# EAGLE design au6850_mp3 (EAGLE 9.0.0)
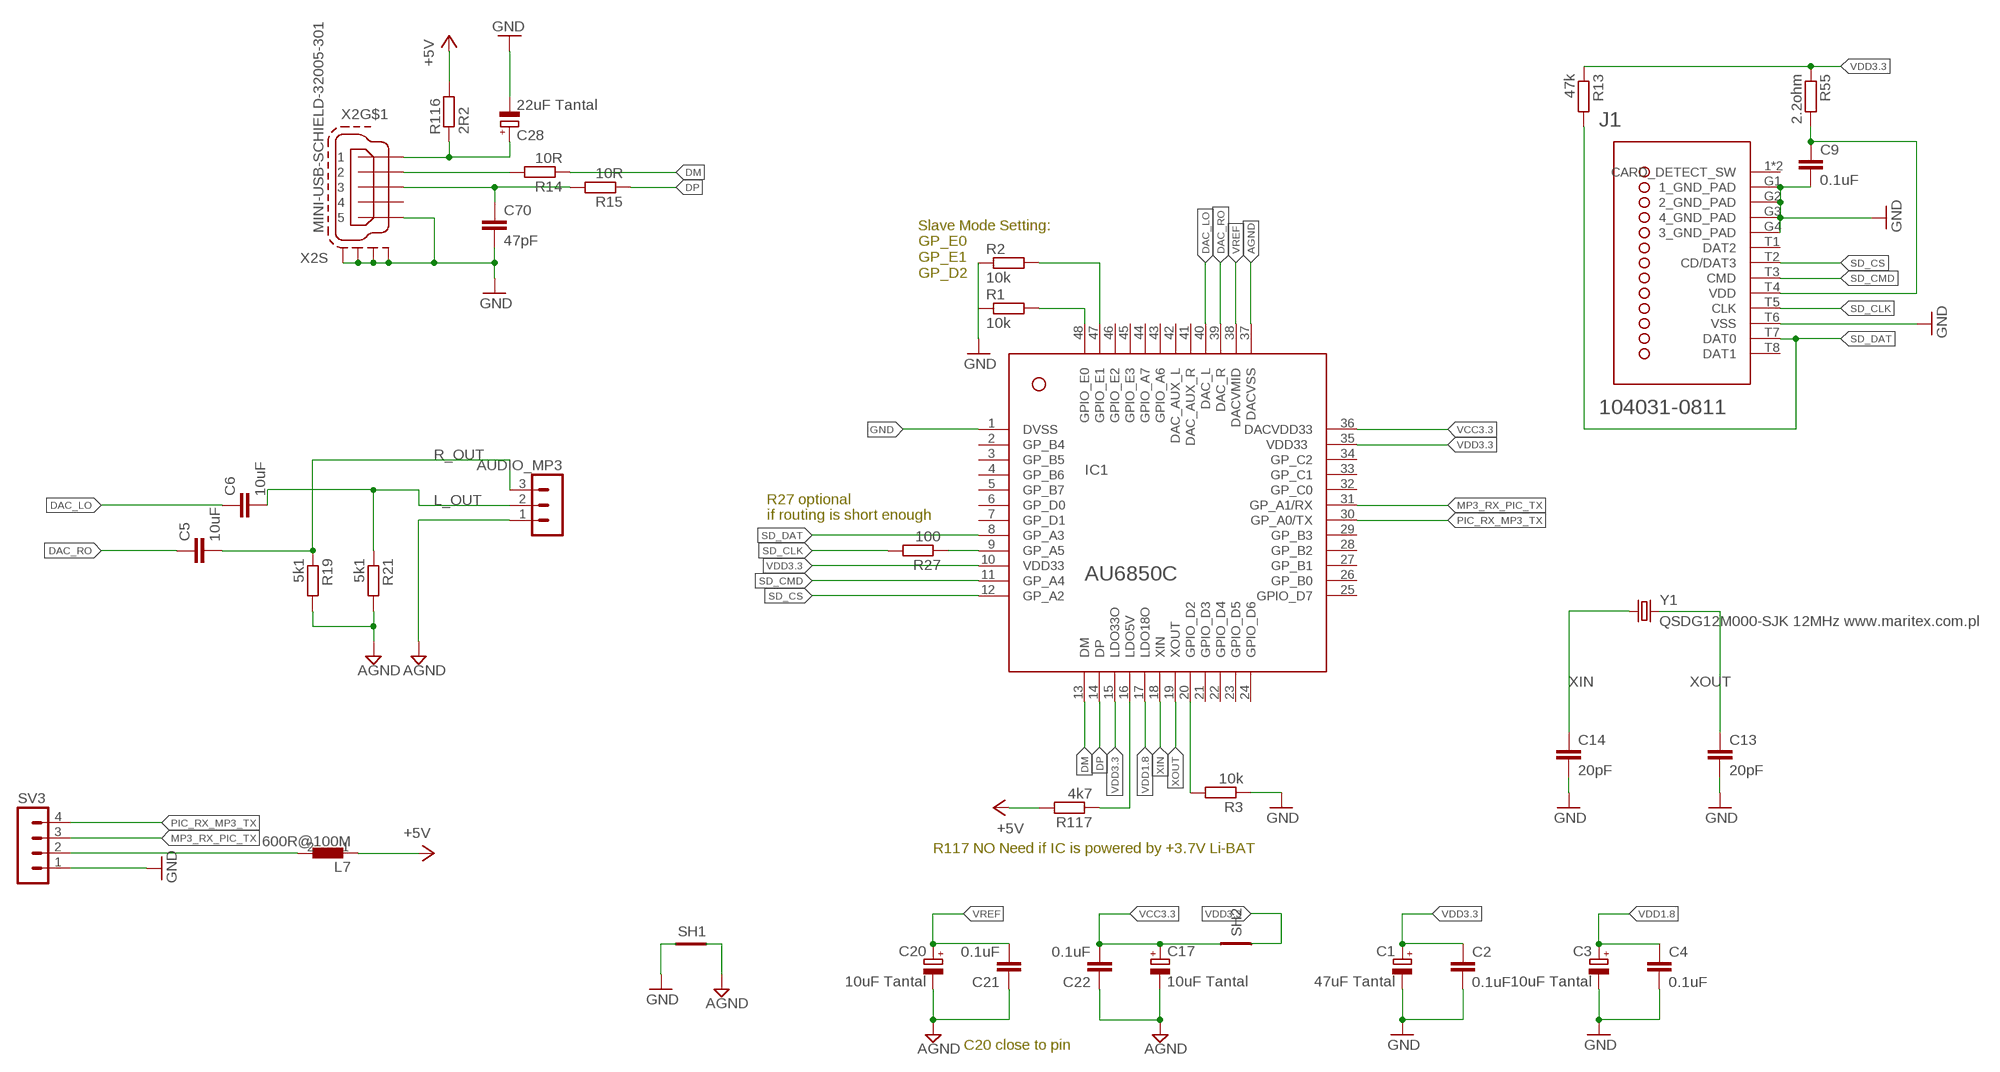
[diagram p0: schematic, sheet 1]

## Parts
AUDIO_MP3  MA03-1  [MA03-1]
C1  47uF Tantal  CPOL-EUB/3528-21R  [B/3528-21R]
C2  0.1uF  C-EUC0805  [C0805]
C3  10uF Tantal  CPOL-EUB/3528-21R  [B/3528-21R]
C4  0.1uF  C-EUC0805  [C0805]
C5  10uF  C-EUC0805  [C0805]
C6  10uF  C-EUC0805  [C0805]
C9  0.1uF  C-EUC0805  [C0805]
C13  20pF  C-EUC0805  [C0805]
C14  20pF  C-EUC0805  [C0805]
C17  10uF Tantal  CPOL-EUB/3528-21R  [B/3528-21R]
C20  10uF Tantal  CPOL-EUB/3528-21R  [B/3528-21R]
C21  0.1uF  C-EUC0805  [C0805]
C22  0.1uF  C-EUC0805  [C0805]
C28  22uF Tantal  CPOL-EUSMCA  [SMC_A]
C70  47pF  C-EUC0805  [C0805]
IC1  AU6850C  [LQFP48-7X7]
J1  MOLEX_104031-0811MOLEX_104031-0811_0_0  [MOLEX_104031-0811_0]
L7  600R@100M  FERRITR0805  [R0805]
R1  10k  R-EU_R0805  [R0805]
R2  10k  R-EU_R0805  [R0805]
R3  10k  R-EU_R0805  [R0805]
R13  47k  R-EU_R0805  [R0805]
R14  10R  R-EU_R0805  [R0805]
R15  10R  R-EU_R0805  [R0805]
R19  5k1  R-EU_R0805  [R0805]
R21  5k1  R-EU_R0805  [R0805]
R27  100  R-EU_R0805  [R0805]
R55  2.2ohm  R-EU_R0805  [R0805]
R116  2R2  R-EU_R0805  [R0805]
R117  4k7  R-EU_R0805  [R0805]
SH1  SHORT-HT5  [SHORT_TOP-50]
SH2  SHORT-V12_MILS  [12_MILS]
SV3  MA04-1  [MA04-1]
X2  MINI-USB-SCHIELD-32005-301  [32005-301]
Y1  QSDG12M000-SJK 12MHz www.maritex.com.pl  CRYSTALTXC-7A  [CRYSTAL-TXC-7A]

## Nets
+5V: L7.1 R116.2 R117.2
AGND: AUDIO_MP3.1 C17.- C20.- C21.1 C22.1 IC1.37(DACVSS) R19.2 R21.2 SH1.2
DAC_LO: C6.1 IC1.40(DAC_L)
DAC_RO: C5.1 IC1.39(DAC_R)
DM: IC1.13(DM) R14.1
DP: IC1.14(DP) R15.1
GND: C1.- C2.2 C3.- C4.2 C9.2 C13.2 C14.2 C28.- C70.2 IC1.1(DVSS) J1.G1(1_GND_PAD) J1.G2(2_GND_PAD) J1.G3(4_GND_PAD) J1.G4(3_GND_PAD) J1.T6(VSS) R1.1 R2.1 R3.1 SH1.1 SV3.1 X2.5 X2.M1(S:S1) X2.M2(S:S2) X2.M3(S:S3) X2.M4(S:S4)
L_OUT: AUDIO_MP3.2 C6.2 R21.1
MP3_RX_PIC_TX: IC1.31(GP_A1/RX) SV3.3
N$4: IC1.16(LDO5V) R117.1
N$5: IC1.9(GP_A5) R27.1
N$8: C28.+ R116.1 X2.1
N$9: C70.1 R15.2 X2.3
N$10: R14.2 X2.2
N$13: L7.2 SV3.2
N$14: C9.1 J1.T4(VDD) R55.2
PIC_RX_MP3_TX: IC1.30(GP_A0/TX) SV3.4
R_OUT: AUDIO_MP3.3 C5.2 R19.1
SD_CLK: J1.T5(CLK) R27.2
SD_CMD: IC1.11(GP_A4) J1.T3(CMD)
SD_CS: IC1.12(GP_A2) J1.T2(CD/DAT3)
SD_DAT: IC1.8(GP_A3) J1.T7(DAT0) R13.2
SLAVE_D2: IC1.20(GPIO_D2) R3.2
SLAVE_E0: IC1.48(GPIO_E0) R1.2
SLAVE_E1: IC1.47(GPIO_E1) R2.2
VCC3.3: C17.+ C22.2 IC1.36(DACVDD33) SH2.P$2
VDD1.8: C3.+ C4.1 IC1.17(LDO18O)
VDD3.3: C1.+ C2.1 IC1.10(VDD33) IC1.15(LDO33O) IC1.35(VDD33) R13.1 R55.1 SH2.P$1
VREF: C20.+ C21.2 IC1.38(DACVMID)
XIN: C14.1 IC1.18(XIN) Y1.P$1
XOUT: C13.1 IC1.19(XOUT) Y1.P$2
Unconnected: IC1.2(GP_B4) IC1.3(GP_B5) IC1.4(GP_B6) IC1.5(GP_B7) IC1.6(GP_D0) IC1.7(GP_D1) IC1.21(GPIO_D3) IC1.22(GPIO_D4) IC1.23(GPIO_D5) IC1.24(GPIO_D6) IC1.25(GPIO_D7) IC1.26(GP_B0) IC1.27(GP_B1) IC1.28(GP_B2) IC1.29(GP_B3) IC1.32(GP_C0) IC1.33(GP_C1) IC1.34(GP_C2) IC1.41(DAC_AUX_R) IC1.42(DAC_AUX_L) IC1.43(GPIO_A6) IC1.44(GPIO_A7) IC1.45(GPIO_E3) IC1.46(GPIO_E2) J1.1(CARD_DETECT_SW) J1.1-2(CARD_DETECT_SW) J1.T1(DAT2) J1.T8(DAT1) X2.4

## Notes on the sheet
- Slave Mode Setting:
  GP_E0
  GP_E1
  GP_D2
- R27 optional
  if routing is short enough
- R117 NO Need if IC is powered by +3.7V Li-BAT
- C20 close to pin

## Library data of the parts
AUDIO_MP3 = con-lstb:MA03-1: PIN HEADER; OC_FARNELL: unknown; OC_NEWARK: unknown
C1 C3 C17 C20 C28 = rcl:CPOL-EU: POLARIZED CAPACITOR, European symbol
C2 C4-C6 C21 C22 = rcl:C-EU: CAPACITOR, European symbol
C9 C13 C14 C70 = resistor:C-EU: CAPACITOR, European symbol
IC1 = mvsilicon:AU6850C
J1 = Molex - 104031-0811:MOLEX_104031-0811: 1.10mm Pitch microSD* Memory Card Connector, Surface Mount, Push-Pull Type, 1.42mm Height, with Detect Switch; CENTROID_NOT_SPECIFIED: No; DATASHEET: http://www.molex.com/pdm_docs/sd/1040310811_sd.pdf; DIGIKEY_DESCRIPTION: CONN MICRO SD CARD PUSH-PULL R/A; DIGIKEY_PART_NUMBER: WM6357CT-ND; IS_FEMALE: yes; LEAD_FREE: yes; MF: Molex; MOUSER_PART_NUMBER: WM6357CT-ND; MPN: 104031-0811; PACKAGE: SMT_MICROSD_SOCKET; PREFIX: J; ROHS: yes; TEMPERATURE_RANGE_HIGH: +85°C; TEMPERATURE_RANGE_LOW: -25°C
L7 = ferrit_bear:FERRIT
R1-R3 R13-R15 R19 R21 R27 R55 R116 R117 = rcl:R-EU_: RESISTOR, European symbol
SH1 = shorts-old:SHORT-H: Short between two nets; BOM: no
SH2 = shorts-old:SHORT-V: Short between two nets
SV3 = con-lstb:MA04-1: PIN HEADER; OC_FARNELL: unknown; OC_NEWARK: unknown
X2 = con-cypressindustries:MINI-USB-SCHIELD-: MINI USB-B Conector Source: www.cypressindustries.com; OC_FARNELL: unknown; OC_NEWARK: unknown
Y1 = SparkFun-FreqCtrl:CRYSTAL: Various standard crystals. Proven footprints. Spark Fun Electronics SKU : COM-00534

## Board
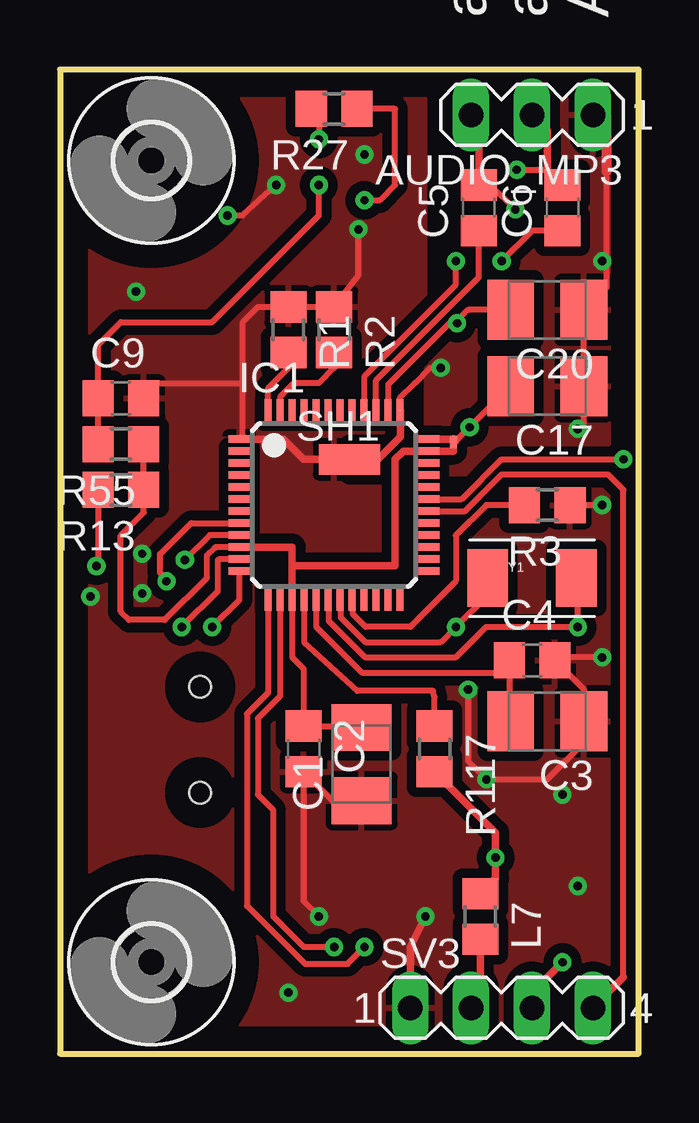
[diagram p1: board, top side]
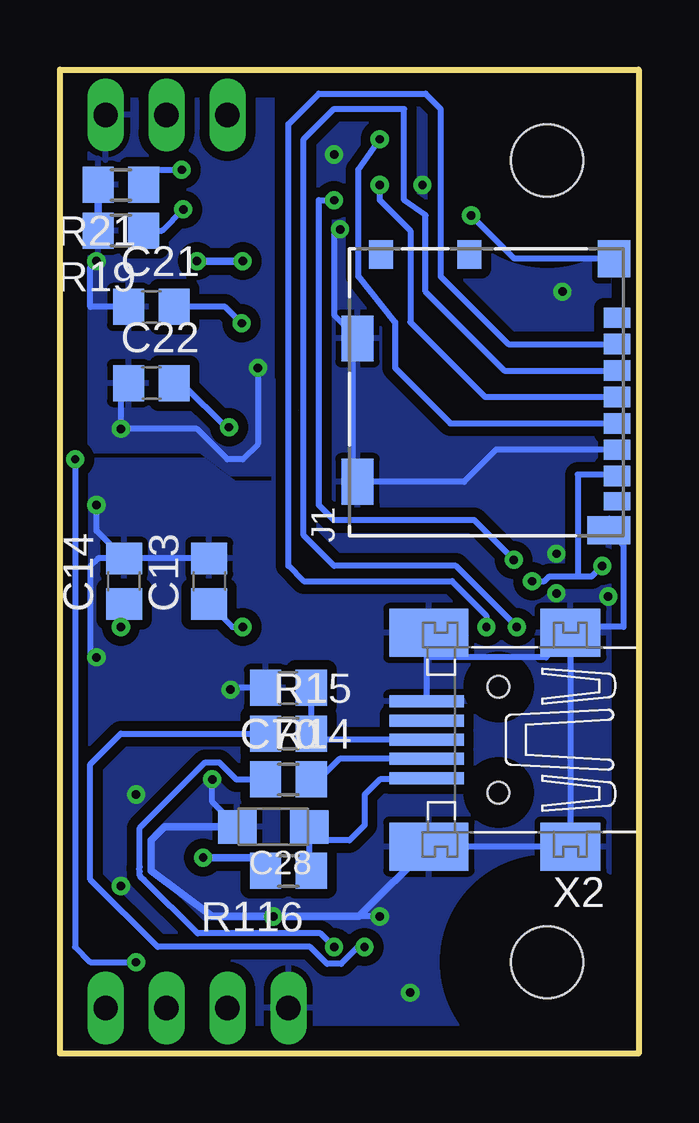
[diagram p2: board, bottom side, seen from below]

Size 24.13 x 41 mm. Coordinates in mm from the lower left corner, seen from the top.
Outline: 0,0 24.13,0 24.13,41 0,41 0,0
Copper layers (1*16): Top 0.035mm / dielectric 1.5mm / Bottom 0.035mm
Design rules "default *": minimum track width 10mil, minimum drill 24mil, track to track 8mil, track to pad 8mil, pad to pad 8mil, via to via 8mil, smd to smd 8mil, copper to edge 40mil, drill to drill 8mil, minimum pad ring 10mil, minimum via ring 8mil, stop-mask expansion 4mil, vias tented up to drill 0mil, thermal gap 10mil

### Footprints (pad centres in the part's own frame; a part is rotated, then mirrored left to right if it is on the bottom)
MA03-1 = drill 1.016 long: 1 -2.54,0; 2 0,0; 3 2.54,0
B/3528-21R = smd 1.95 x 2.5: + 1.525,0; - -1.525,0
C0805 = smd 1.3 x 1.5: 1 -0.95,0; 2 0.95,0
SMC_A = smd 1.6 x 1.4: + -1.5,0; - 1.5,0
LQFP48-7X7 = smd 0.9 x 0.3: 1 -3.95,2.75; 2 -3.95,2.25; 3 -3.95,1.75; 4 -3.95,1.25; 5 -3.95,0.75; 6 -3.95,0.25; 7 -3.95,-0.25; 8 -3.95,-0.75; 9 -3.95,-1.25; 10 -3.95,-1.75; 11 -3.95,-2.25; 12 -3.95,-2.75; 25 3.95,-2.75; 26 3.95,-2.25; 27 3.95,-1.75; 28 3.95,-1.25; 29 3.95,-0.75; 30 3.95,-0.25; 31 3.95,0.25; 32 3.95,0.75; 33 3.95,1.25; 34 3.95,1.75; 35 3.95,2.25; 36 3.95,2.75 | smd 0.3 x 0.9: 13 -2.75,-3.95; 14 -2.25,-3.95; 15 -1.75,-3.95; 16 -1.25,-3.95; 17 -0.75,-3.95; 18 -0.25,-3.95; 19 0.25,-3.95; 20 0.75,-3.95; 21 1.25,-3.95; 22 1.75,-3.95; 23 2.25,-3.95; 24 2.75,-3.95; 37 2.75,3.95; 38 2.25,3.95; 39 1.75,3.95; 40 1.25,3.95; 41 0.75,3.95; 42 0.25,3.95; 43 -0.25,3.95; 44 -0.75,3.95; 45 -1.25,3.95; 46 -1.75,3.95; 47 -2.25,3.95; 48 -2.75,3.95
MOLEX_104031-0811_0 = smd 1.2 x 1: 1 5.74,4.4; 1-2 5.74,0.7 | smd 1.55 x 1.35: G1 5.565,-5.325 | smd 1.17 x 1.8: G2 -5.755,-5.1 | smd 1.9 x 1.35: G3 -3.73,5.375; G4 2.24,5.375 | smd 0.85 x 1.1: T1 3.105,-5.45; T2 2.005,-5.45; T3 0.905,-5.45; T4 -0.195,-5.45; T5 -1.295,-5.45; T6 -2.395,-5.45; T7 -3.495,-5.45 | smd 0.75 x 1.1: T8 -4.545,-5.45
R0805 = smd 1.3 x 1.5: 1 -0.95,0; 2 0.95,0
SHORT_TOP-50 = smd 1.27 x 1.27: 1 0.635,0; 2 -0.635,0
12_MILS = smd 0.254 x 0.305: P$1 -0.127,0; P$2 0.127,0
MA04-1 = drill 1.016 long: 1 -3.81,0; 2 -1.27,0; 3 1.27,0; 4 3.81,0
3,0 = hole 3: 0,0
32005-301 = smd 3.1 x 0.5: 1 3,1.6; 2 3,0.8; 3 3,0; 4 3,-0.8; 5 3,-1.6 | smd 2.5 x 2: M1 -3,-4.45; M2 -3,4.45 | smd 3.3 x 2: M3 2.9,4.45; M4 2.9,-4.45 | hole 0.9: 0,2.2; 0,-2.2
CRYSTAL-TXC-7A = smd 1.7 x 2.4: P$1 1.85,0; P$2 -1.85,0

### Placement (x,y rotation side)
AUDIO_MP3  19.69,39.12 180 top
C1  12.57,12.06 90 top
C2  10.16,12.7 270 top
C3  20.32,13.84 180 top
C4  19.69,16.38 0 top
C5  17.46,35.24 90 top
C6  20.95,35.24 90 top
C9  2.54,27.3 0 top
C13  17.91,19.68 90 bottom
C14  21.46,19.68 90 bottom
C17  20.32,27.81 180 top
C20  20.32,30.99 180 top
C21  20.32,31.11 0 bottom
C22  20.32,27.94 0 bottom
C28  15.24,9.45 180 bottom
C70  14.6,15.24 180 bottom
IC1  11.43,22.86 0 top
J1  6.35,27.56 90 bottom
L7  17.53,5.71 270 top
R1  9.52,30.16 270 top
R2  11.43,30.16 270 top
R3  20.32,22.86 180 top
R13  2.54,23.5 180 top
R14  14.6,11.43 0 bottom
R15  14.6,13.34 0 bottom
R19  21.59,34.29 180 bottom
R21  21.59,36.2 180 bottom
R27  11.43,39.37 180 top
R55  2.54,25.4 180 top
R116  14.6,7.62 180 bottom
R117  15.62,12.7 270 top
SH1  12.06,24.77 180 top
SH2  16.41,25.49 90 top
SV3  18.41,1.91 0 top
U$1  [3,0]  3.81,37.21 0 top
U$2  [3,0]  3.81,3.81 0 top
X2  5.84,13.08 180 bottom
Y1  19.69,19.81 0 top

### Tracks (layer width: path | path; a pad name or v marks a point on that pad's centre or on a via)
+5V  (via drill 0.35)
  Top 0.305: R117.2 18.16,9.21 v18.16,8.17 18.16,7.3 L7.1
  Bottom 0.305: R116.2 16.1,8.17 v18.16,8.17
AGND  (via drill 0.35)  (1 unrouted)
  Top 0.254: IC1.37 14.18,27.09 14.16,27.11 14.16,27.3 14.8,27.94 15.43,28.57 v15.88,28.57 | v21.59,26.04 21.84,26.29 C17.- C20.- 22.78,31.93 22.78,33.02 | 22.78,36.75 22.78,33.02 | v22.61,33.02 22.78,33.02
  Top 0.305: SH1.2 13.25,24.77 14.19,25.7 IC1.37
  Top 0.406: 22.78,39.05 22.78,36.75
  Bottom 0.254: C22.1 21.59,27.62 v21.59,26.04 18.41,26.04 17.14,24.77 16.51,24.77 15.88,25.4 v15.88,28.57 | 21.27,31.68 C21.1 22.86,31.11 22.86,32.77 v22.61,33.02
  Bottom 0.305: R19.2 R21.2
  pour Bottom (isolate 0.406): 15.24,41.91 15.24,24.13 17.02,24.13 18.29,25.08 26.03,25.08 26.03,41.91
  pour Top (isolate 0.406): 15.24,41.91 15.24,24.13 17.02,24.13 18.29,25.08 26.03,25.08 26.03,41.91
DAC_LO  (via drill 0.35)
  Top 0.254: IC1.40 12.7,26.83 12.7,28.23 16.51,32.04 v16.51,33.02 | C6.1 19.69,34.29 v18.41,33.02
  Bottom 0.305: v18.41,33.02 v16.51,33.02
DAC_RO
  Top 0.254: IC1.39 13.18,28.06 16.05,30.94 16.16,31.04 17.46,32.34 C5.1
DM  (via drill 0.35)
  Top 0.254: IC1.13 8.68,15.04 7.8,14.16 7.8,6.16 10.22,3.74 11.99,3.74 v12.7,4.45
  Bottom 0.254: v12.7,4.45 13.26,5.01 18.39,5.01 20.64,7.25 20.77,7.35 20.77,7.39 20.8,7.42 20.8,7.59 20.83,7.75 20.8,7.78 20.8,9.41 18.07,12.14 17.49,12.14 16.78,11.43 R14.1
DP  (via drill 0.35)
  Top 0.254: 9.16,18.89 IC1.14 9.18,14.89 8.25,13.97 8.25,10.79 8.89,10.16 8.89,5.71 10.16,4.45 v11.43,4.45
  Bottom 0.254: R15.1 21.59,13.34 22.86,12.06 22.86,7.25 20.05,4.45 13.7,4.45 12.99,3.74 12.41,3.74 11.7,4.45 v11.43,4.45
GND  (via drill 0.35)
  Top 0.254: v22.61,22.86 R3.1 | v22.61,16.51 20.76,16.51 C4.2 21.84,15.17 C3.- 21.84,12.96 20.32,11.43 v17.78,11.43 17.02,12.19 v17.02,15.17 | C1.- 11.37,10.54 C2.2 10.16,6.35 v10.79,5.71 | v12.45,34.35 12.45,32.44 R2.1 R1.1 8.26,31.11 7.62,30.47 7.62,27.94 | IC1.1 7.62,25.75 7.62,27.94 | v6.98,34.92 7.62,34.92 v9.02,36.2 | C9.2 4.12,27.94 7.62,27.94
  Top 0.305: IC1.1 9.31,25.61 10.16,24.77 SH1.1 | SV3.1 14.6,4.45 v15.24,5.71
  Bottom 0.152: J1.G2 1.22,21.8 1.22,22.36
  Bottom 0.254: 9.52,17.78 8.89,18.41 8.74,18.27 X2.M4 8.84,17.43 8.84,16.51 | X2.M3 X2.M2 X2.M1 | 8.84,16.51 X2.5 | C13.2 C14.2 | C14.2 22.61,21.78 v22.61,22.86 | X2.M1 3.86,16.51 8.84,16.51 | C14.2 22.55,20.64 22.86,20.32 22.86,16.51 v22.61,16.51 | C70.2 17.14,15.24 v17.02,15.17 | C28.- 17.78,10.49 v17.78,11.43 | v12.45,34.35 12.7,34.29 12.7,30.77 11.92,29.99 | 11.92,29.99 J1.G4 | J1.T6 5.95,25.16 7.29,23.83 J1.G3 11.92,24.02 11.92,29.99 | J1.G2 0.63,21.19 0.63,17.78 2.59,17.78 X2.M1 | J1.G1 5.18,33.12 v6.98,34.92 | v10.79,5.71 11.66,5.71
  Bottom 0.305: X2.M3 11.66,5.71 v15.24,5.71 17.78,5.71 20.32,7.62 20.32,8.89 19.76,9.45 C28.-
  other vias: 12.7,37.47 3.17,31.75 20.95,10.79 21.59,6.99 9.52,2.54 1.27,19.05 3.43,20.83 3.43,19.18
  pour Top (isolate 0.406): -1.59,41.91 15.24,41.91 15.24,23.81 16.83,23.81 18.1,24.77 25.72,24.77 25.72,-1.91 25.4,-1.59 -1.59,-1.59
  pour Bottom (isolate 0.406): -1.59,41.91 15.24,41.91 15.24,23.81 16.83,23.81 18.1,24.77 26.99,24.77 26.99,-1.59 -1.59,-1.59
L_OUT  (via drill 0.35)
  Top 0.254: v19.05,36.83 20.32,36.83 C6.2
  Top 0.305: v19.05,36.83 | AUDIO_MP3.2 20.32,38.48 20.32,36.83
  Bottom 0.254: R21.1 20,36.83 v19.05,36.83
MP3_RX_PIC_TX  (via drill 0.35)
  Top 0.254: IC1.31 16.76,23.11 18.41,24.77 v23.49,24.77
  Top 0.305: v20.95,3.81 19.69,2.54 SV3.3
  Bottom 0.254: v23.49,24.77 23.49,4.45 22.86,3.81 v20.95,3.81
N$4
  Top 0.254: IC1.16 10.18,17.14 | 10.18,17.14 10.18,17.12 | R117.1 15.62,14.86 15.56,15.11 12.4,15.11 10.18,17.14
N$5  (via drill 0.35)
  Top 0.254: R27.1 13.97,39.37 13.97,36.2 13.33,35.56 v12.7,35.56 | IC1.9 6.24,21.61 v5.21,20.57
  Bottom 0.254: v12.7,35.56 13.33,35.56 13.33,22.86 12.7,22.23 6.86,22.23 v5.21,20.57
N$8
  Bottom 0.254: C28.+ 13.74,8.89 | 13.74,8.89 13.74,8.34 R116.1 | X2.1 8.89,11.43 10.79,11.43 11.43,10.79 11.43,9.53 12.06,8.89 13.74,8.89
N$9
  Bottom 0.254: C70.1 R15.2 14.04,13.08 X2.3
N$10
  Bottom 0.254: X2.2 12.48,12.28 13.33,11.43 R14.2
N$13
  Top 0.305: SV3.2 17.53,2.29 L7.2
N$14  (via drill 0.35)
  Top 0.254: R55.2 C9.1 1.59,29.53 2.54,30.48 6.35,30.48 10.79,34.92 v10.79,36.2
  Bottom 0.254: v10.79,36.2 10.79,35.56 9.52,34.29 9.52,30.48 6.41,27.36 J1.T4
PIC_RX_MP3_TX
  Top 0.254: 15.4,22.59 IC1.30 16.89,22.61 18.41,24.13 22.86,24.13 23.49,23.5 23.49,3.17
  Top 0.305: 23.49,3.17 SV3.4
R_OUT  (via drill 0.35)
  Top 0.254: v18.99,35.18 17.98,36.19 17.72,36.19
  Top 0.305: 17.72,36.19 C5.2 17.46,38.8 AUDIO_MP3.3
  Bottom 0.254: R19.1 19.88,34.29 v18.99,35.18
SD_CLK  (via drill 0.35)
  Top 0.254: R27.2 10.79,39.05 v10.79,38.1
  Bottom 0.254: J1.T5 7.85,26.26 10.16,28.57 10.16,30.48 11.68,32.38 11.68,36.83 v10.79,38.1
SD_CMD  (via drill 0.35)
  Top 0.254: IC1.11 6.64,20.61 6.6,20.57 6.59,20.57 6.59,19.29 v5.08,17.78
  Bottom 0.254: J1.T3 5.6,28.46 8.89,31.75 8.89,34.92 9.78,35.56 9.78,39.37 12.7,39.37 13.97,38.1 13.97,21.59 12.7,20.32 7.62,20.32 v5.08,17.78
SD_CS  (via drill 0.35)
  Top 0.254: v6.35,17.78 7.48,18.91 IC1.12
  Bottom 0.254: J1.T2 5.43,29.56 8.25,32.38 8.25,39.37 8.89,40.01 13.33,40.01 14.6,38.73 14.6,20.32 13.97,19.68 7.78,19.68 6.35,18.26 v6.35,17.78
SD_DAT  (via drill 0.35)
  Top 0.254: 1.3,23.2 R13.2 1.59,20.39 v1.52,20.32 | v4.45,19.68 4.18,20.05 4.18,20.81 5.48,22.11 IC1.8
  Bottom 0.254: J1.T7 0.97,24.13 2.54,24.13 2.54,19.89 | 1.68,20.48 v1.52,20.32 1.96,19.89 2.54,19.89 | v4.45,19.68 3.92,19.68 3.72,19.89 2.54,19.89
SLAVE_D2
  Top 0.254: IC1.20 12.2,18.89 12.2,18.32 12.74,17.78 14.6,17.78 16.51,19.68 16.51,21.59 17.78,22.86 R3.2
SLAVE_E0
  Top 0.254: IC1.48 8.68,27.73 9.52,28.57 R1.2
SLAVE_E1
  Top 0.254: IC1.47 9.2,26.83 9.2,27.4 9.74,27.94 10.79,27.94 11.43,28.57 R2.2
VCC3.3  (via drill 0.35)
  Top 0.254: SH2.P$2 16.6,25.62 v17.08,26.1 C17.+
  Top 0.305: IC1.36 SH2.P$2 | SH2.P$2 | 16.49,25.53 SH2.P$2
  Bottom 0.254: C22.2 19.05,27.94 17.14,26.04 v17.08,26.1
VDD1.8
  Top 0.254: IC1.17 10.68,17.78 12.58,15.88 18.23,15.88 C4.1 18.73,13.9 C3.+
VDD3.3
  Top 0.254: 9.66,18.89 IC1.15 9.68,16.51 10.16,16.03 C2.1 13.15,13.65 C1.+ | IC1.10 6.5,21.11 6.46,21.07 6.44,21.07 6.13,20.76 6.13,19.83 4.37,18.07 2.88,18.07 2.54,18.41 2.54,21.59 3.49,22.54 R13.1 R55.1
  Top 0.305: 9.68,20.32 9.68,21.11 IC1.10 | 9.68,20.32 IC1.15 | 9.68,20.32 13.97,20.32 13.97,24.77 14.31,25.11 IC1.35 16.41,25.11 SH2.P$1
VREF  (via drill 0.35)
  Top 0.254: IC1.38 13.7,26.83 13.7,27.89 16.25,30.43 v16.55,30.43 16.51,30.48 17.02,30.99 C20.+
  Bottom 0.254: v16.55,30.43 17.23,31.11 C21.2
XIN  (via drill 0.35)
  Top 0.254: IC1.18 11.2,18.89 11.2,18.03 12.71,16.52 16.52,16.52 17.78,17.78 v21.59,17.78 21.59,19.76 Y1.P$1
  Bottom 0.254: 21.46,18.29 C14.1 21.46,17.91 v21.59,17.78
XOUT  (via drill 0.35)
  Top 0.254: IC1.19 11.7,18.89 11.7,18.18 12.73,17.14 15.88,17.14 v16.51,17.78 17.84,19.11 Y1.P$2
  Bottom 0.254: C13.1 16.95,17.78 v16.51,17.78

### Text on the board
tPlace: audio left channel output | audio right channel output | AGND